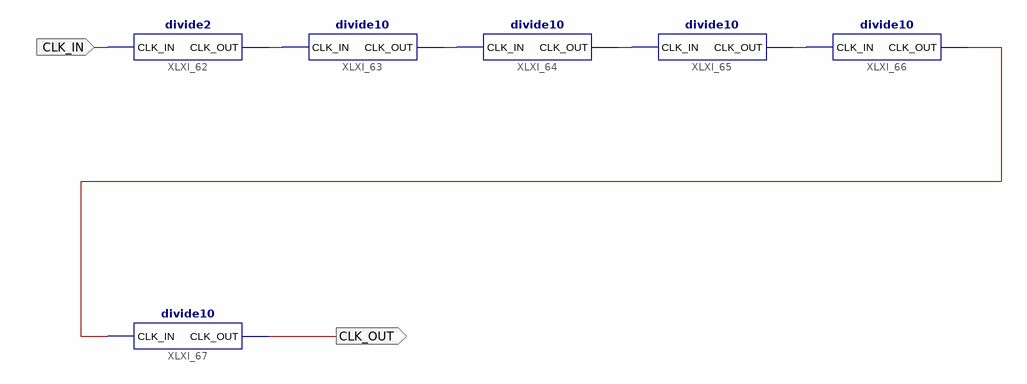
[diagram p0: schematic sheet 1]
// Xilinx ISE schematic Divider.sch (spartan6) as structural Verilog: 6 symbols, 2 ports
module Divider (
  input  CLK_IN,
  output CLK_OUT
);

  wire XLXN_124, XLXN_125, XLXN_126, XLXN_127, XLXN_145;

  divide10 XLXI_67 (.CLK_IN(XLXN_145), .CLK_OUT(CLK_OUT));
  divide2 XLXI_62 (.CLK_IN(CLK_IN), .CLK_OUT(XLXN_124));
  divide10 XLXI_63 (.CLK_IN(XLXN_124), .CLK_OUT(XLXN_125));
  divide10 XLXI_64 (.CLK_IN(XLXN_125), .CLK_OUT(XLXN_126));
  divide10 XLXI_65 (.CLK_IN(XLXN_126), .CLK_OUT(XLXN_127));
  divide10 XLXI_66 (.CLK_IN(XLXN_127), .CLK_OUT(XLXN_145));
endmodule
